# EAGLE schematic rc6551z00_v1 (EAGLE 9.6.2)
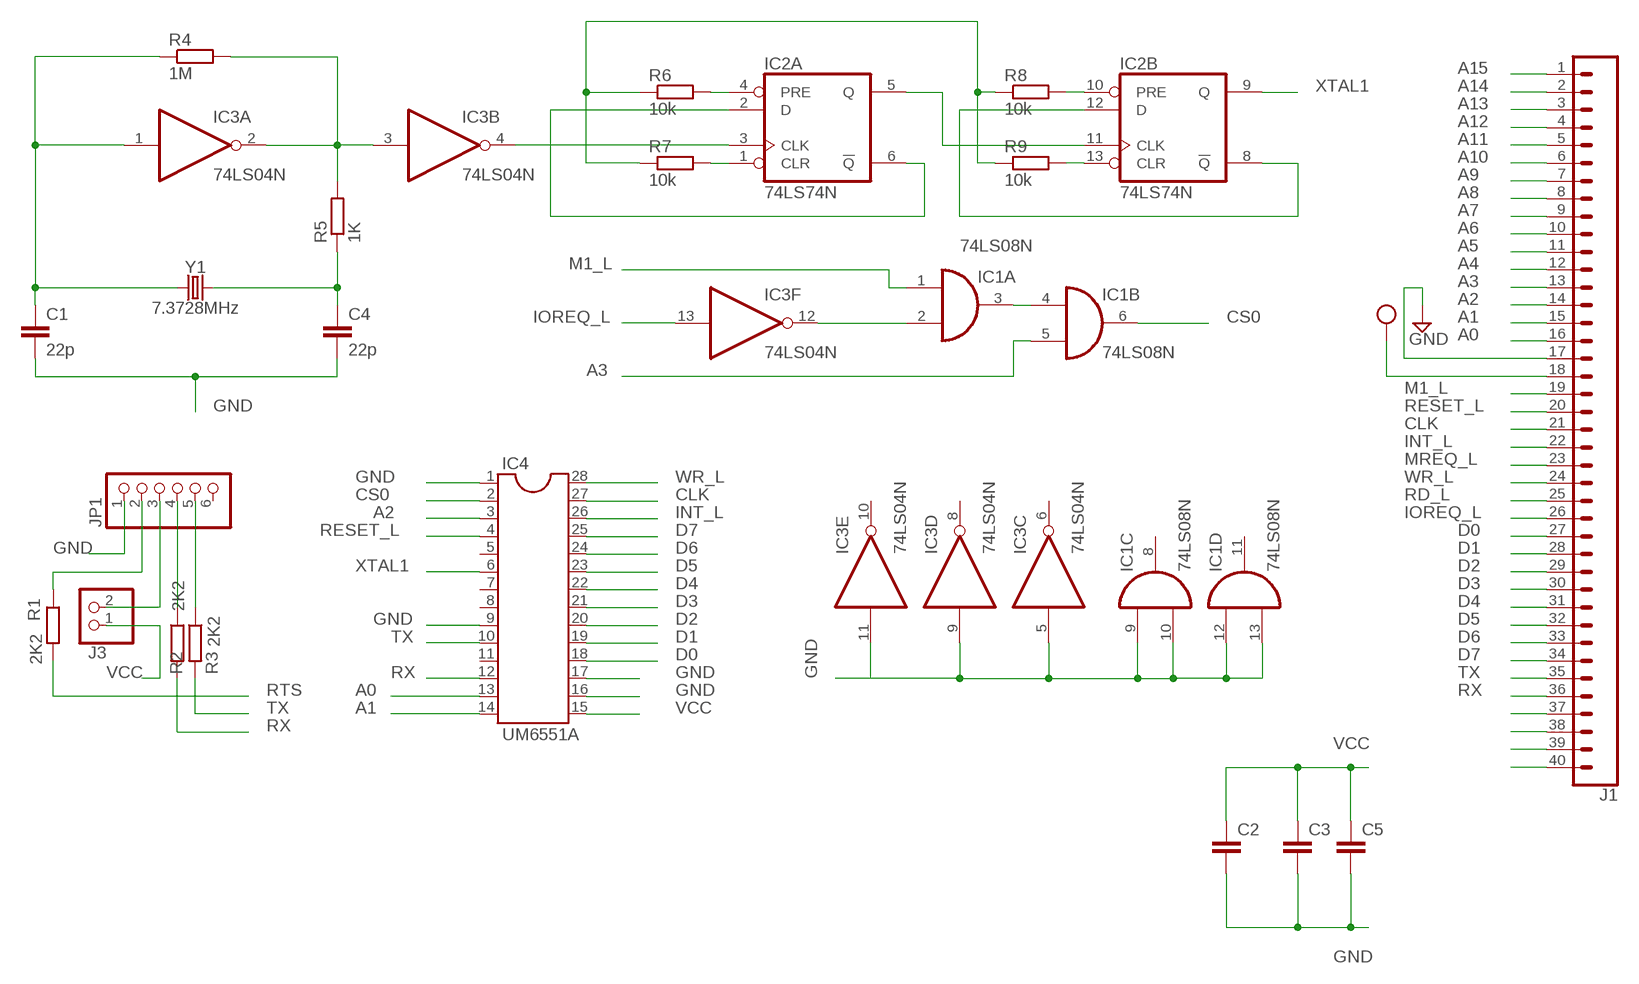
[diagram p0: schematic, sheet 1]

## Parts
C1  22p  C-EU025-024X044  [C025-024X044]
C2  C-EU050-025X075  [C050-025X075]
C3  C-EU050-025X075  [C050-025X075]
C4  22p  C-EU025-024X044  [C025-024X044]
C5  C-EU050-025X075  [C050-025X075]
IC1  74LS08N  [DIL14]
IC2  74LS74N  [DIL14]
IC3  74LS04N  [DIL14]
IC4  UM6551A  DIL28  [DIL28-6]
J1  CONN_40OFFSET  [1X40_OFFSET]
J3  PINHD-1X2  [1X02]
JP1  PINHD-1X6  [1X06]
R1  2K2  R-EU_0204/7  [0204/7]
R2  2K2  R-EU_0204/7  [0204/7]
R3  2K2  R-EU_0204/7  [0204/7]
R4  1M  R-EU_0204/5  [0204/5]
R5  1K  R-EU_0204/5  [0204/5]
R6  10k  R-EU_0204/7  [0204/7]
R7  10k  R-EU_0204/7  [0204/7]
R8  10k  R-EU_0204/7  [0204/7]
R9  10k  R-EU_0204/7  [0204/7]
Y1  7.3728MHz  CRYSTALPTH-HC49UV  [HC49U]

## Nets
A0: IC4.13 J1.16
A1: IC4.14 J1.15
A2: IC4.3 J1.14
A3: IC1.5(B:I1) J1.13
A4: J1.12
A5: J1.11
A6: J1.10
A7: J1.9
A8: J1.8
A9: J1.7
A10: J1.6
A11: J1.5
A12: J1.4
A13: J1.3
A14: J1.2
A15: J1.1
CLK: IC4.27 J1.21
CLK_F: IC2.3(A:CLK) IC3.4(B:O)
CS0: IC1.6(B:O) IC4.2
D0: IC4.18 J1.27
D1: IC4.19 J1.28
D2: IC4.20 J1.29
D3: IC4.21 J1.30
D4: IC4.22 J1.31
D5: IC4.23 J1.32
D6: IC4.24 J1.33
D7: IC4.25 J1.34
GND: C1.2 C2.2 C3.2 C4.2 C5.2 IC1.9(C:I0) IC1.10(C:I1) IC1.12(D:I0) IC1.13(D:I1) IC3.5(C:I) IC3.9(D:I) IC4.1 IC4.9 IC4.16 IC4.17 J1.17 JP1.1
INT_L: IC4.26 J1.22
IOREQ_L: IC3.13(F:I) J1.26
M1_L: IC1.1(A:I0) J1.19
MREQ_L: J1.23
N$1: J1.37
N$2: J1.38
N$3: J1.39
N$4: R6.1 R7.1 R8.1 R9.1
N$5: JP1.2 R1.1
N$6: J3.2 JP1.3
N$7: JP1.4 R2.1
N$8: JP1.5 R3.1
N$9: C1.1 IC3.1(A:I) R4.1 Y1.1
N$10: C4.1 R5.1 Y1.2
N$11: IC3.2(A:O) IC3.3(B:I) R4.2 R5.2
N$12: IC1.2(A:I1) IC3.12(F:O)
N$13: J1.40
N$14: IC1.3(A:O) IC1.4(B:I0)
N$15: IC2.5(A:Q) IC2.11(B:CLK)
N$16: IC3.11(E:I)
N$17: IC2.4(A:PRE) R6.2
N$18: IC2.1(A:CLR) R7.2
N$19: IC2.2(A:D) IC2.6(A:!Q)
N$20: IC2.10(B:PRE) R8.2
N$21: IC2.13(B:CLR) R9.2
N$22: IC2.8(B:!Q) IC2.12(B:D)
RD_L: J1.25
RESET_L: IC4.4 J1.20
RTS: R1.2
RX: IC4.12 J1.36 R2.2
TX: IC4.10 J1.35 R3.2
VCC: C2.1 C3.1 C5.1 IC4.15 J1.18 J3.1
WR_L: IC4.28 J1.24
XTAL1: IC2.9(B:Q) IC4.6
Unconnected: IC1.8(C:O) IC1.11(D:O) IC3.6(C:O) IC3.8(D:O) IC3.10(E:O) IC4.5 IC4.7 IC4.8 IC4.11 JP1.6

## Power pins joined to a net without a drawn wire
GND: IC1.7(P:GND) IC2.7(P:GND) IC3.7(P:GND)
VCC: IC1.14(P:VCC) IC2.14(P:VCC) IC3.14(P:VCC)

## Library data of the parts
C1 C4 = rcl:C-EU: CAPACITOR, European symbol; SPICEPREFIX: C
C2 C3 C5 = LabE:C-EU: CAPACITOR, European symbol; SPICEPREFIX: C
IC1 = 74xx-eu:74*08: Quad 2-input AND gate
IC2 = 74xx-eu:74*74: Dual D type positive edge triggered FLIP FLOP, preset and clear
IC3 = 74xx-eu:74*04: Hex INVERTER
IC4 = ic-package:DIL28: Dual In Line
J1 = SparkFun-Connectors:CONN_40: Multi connection point. Often used as Generic Header-pin footprint for 0.1 inch spaced/style header connections On any of the 0.1 inch spaced packages, you can populate with these: Break Away Headers - Straight <https://www.sparkfun.com/products/116> (PRT-00116) Break Away Male Headers - Right Angle <https://www.sparkfun.com/products/553> (PRT-00553) Female Headers <https://www.sparkfun.com/products/115> (PRT-00115) Break Away Headers - Machine Pin <https://www.sparkfun.com/products/117> (PRT-00117) Break Away Female Headers - Swiss Machine Pin <https://www.sparkfun.com/products/743> (PRT-00743) For SCREWTERMINALS and SPRING TERMINALS visit here: Screw Terimnals on SparkFun.com <https://www.sparkfun.com/search/results?term=Screw+Terminals> (5mm/3.5mm/2.54mm spacing) This device is also useful as a general connection point to wire up your design to another part of your project. Our various solder wires solder well into these plated through hole pads. Hook-Up Wire - Assortment (Stranded, 22 AWG) <https://www.sparkfun.com/products/11375> (PRT-11375) Hook-Up Wire - Assortment (Solid Core, 22 AWG) <https://www.sparkfun.com/products/11367> (PRT-11367) View the entire wire category on our website here <https://www.sparkfun.com/categories/141> Special notes: Molex polarized connector foot print use with SKU : PRT-08231 with associated crimp pins and housings. 1MM SMD Version SKU: PRT-10208 NOTES ON THE VARIANTS LOCK and LOCK_LONGPADS... This footprint was designed to help hold the alignment of a through-hole component (i.e. 6-pin header) while soldering it into place. You may notice that each hole has been shifted either up or down by 0.005 of an inch from it's more standard position (which is a perfectly straight line). This slight alteration caused the pins (the squares in the middle) to touch the edges of the holes. Because they are alternating, it causes a "brace" to hold the component in place. 0.005 has proven to be the perfect amount of "off-center" position when using our standard breakaway headers. Although looks a little odd when you look at the bare footprint, once you have a header in there, the alteration is very hard to notice. Also,if you push a header all the way into place, it is covered up entirely on the bottom side.
J3 = pinhead:PINHD-1X2: PIN HEADER
JP1 = pinhead:PINHD-1X6: PIN HEADER
R1-R9 = rcl:R-EU_: RESISTOR, European symbol; SPICEPREFIX: R
Y1 = SparkFun-Clocks:CRYSTAL: Crystals (Generic) These are passive quartz crystals, which can be used as a clock source for a microcontroller. Crystal's are two-terminal devices. They require external "load" capacitors to generate an oscillating signal.